# Altium project BLDC_Motor_Controller.PrjPcb
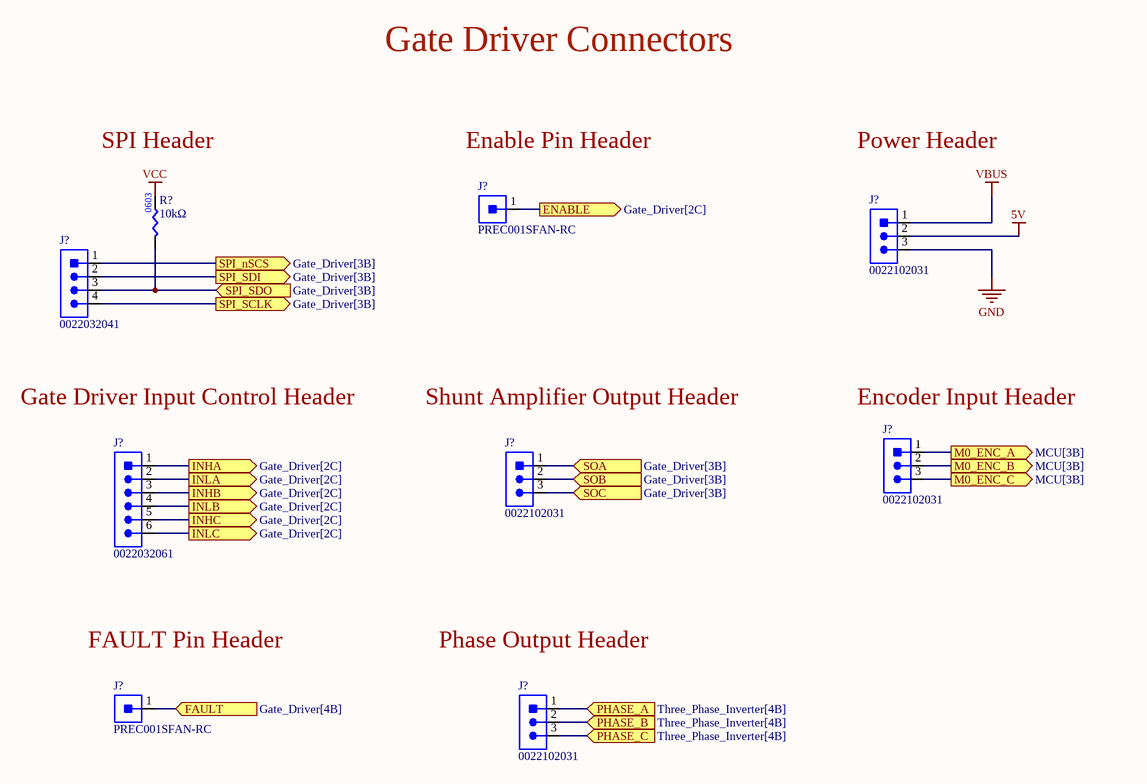
[diagram p0: Gate_Driver_Connectors.SchDoc]
4 sheets, 82 parts. Net scope: flat (ports and power ports of the same name join across sheets).
Sheets:
  Gate_Driver_Connectors.SchDoc
  Gate_Driver.SchDoc
  MCU.SchDoc
  Three_Phase_Inverter.SchDoc

## Sheet Gate_Driver_Connectors.SchDoc
size A4; SheetNumber: 1; SheetTotal: 5

### Parts
(Parts that share a designator on the sheet are numbered #1, #2 ... from top to bottom, then left to right.)
J?#1  Manufacturer Part Number: PREC001SFAN-RC  [HDR_MALE_1X1]  (hidden comment: CON_1X1_2.54MM_MALE_TH_HDR)
J?#2  CON_3X1_2.54MM_MALE_TH_HDR  [0022102031]  (value not drawn)
J?#3  CON_4X1_2.54MM_MALE_TH_HDR  [0022032041]  (value not drawn)
J?#4  CON_3X1_2.54MM_MALE_TH_HDR  [0022102031]  (value not drawn)
J?#5  Manufacturer Part Number 1: 0022032061  [0022284060]  (hidden comment: CON_6X1_2.54MM_MALE_TH_HDR)
J?#6  CON_3X1_2.54MM_MALE_TH_HDR  [0022102031]  (value not drawn)
J?#7  Manufacturer Part Number: PREC001SFAN-RC  [HDR_MALE_1X1]  (hidden comment: CON_1X1_2.54MM_MALE_TH_HDR)
J?#8  CON_3X1_2.54MM_MALE_TH_HDR  [0022102031]  (value not drawn)
R?#1  value 10kΩ  [RES0603]  (hidden comment: RES_10kΩ_0603_1%)

### Ports
ENABLE (out, see Gate_Driver[2C]), FAULT (in, see Gate_Driver[4B]), INHA (out, see Gate_Driver[2C]), INHB (out, see Gate_Driver[2C]), INHC (out, see Gate_Driver[2C]), INLA (out, see Gate_Driver[2C]), INLB (out, see Gate_Driver[2C]), INLC (out, see Gate_Driver[2C]), M0_ENC_A (out, see MCU[3B]), M0_ENC_B (out, see MCU[3B]), M0_ENC_C (out, see MCU[3B]), PHASE_A (in, see Three_Phase_Inverter[4B]), PHASE_B (in, see Three_Phase_Inverter[4B]), PHASE_C (in, see Three_Phase_Inverter[4B]), SOA (in, see Gate_Driver[3B]), SOB (in, see Gate_Driver[3B]), SOC (in, see Gate_Driver[3B]), SPI_nSCS (out, see Gate_Driver[3B]), SPI_SCLK (out, see Gate_Driver[3B]), SPI_SDI (out, see Gate_Driver[3B]), SPI_SDO (in, see Gate_Driver[3B])

### Nets
5V: J?#2.2
GND: J?#2.3
VBUS: J?#2.1
VCC: R?#1.2
NetC?#24_2: J?#8.1 ; port PHASE_A
NetC?#25_2: J?#8.2 ; port PHASE_B
NetC?#26_2: J?#8.3 ; port PHASE_C
NetJ?#1_1: J?#1.1 ; port ENABLE
NetJ?#3_1: J?#3.1 ; port SPI_nSCS
NetJ?#3_2: J?#3.2 ; port SPI_SDI
NetJ?#3_3: J?#3.3 R?#1.1 ; port SPI_SDO
NetJ?#3_4: J?#3.4 ; port SPI_SCLK
NetJ?#4_1: J?#4.1 ; port M0_ENC_A
NetJ?#4_2: J?#4.2 ; port M0_ENC_B
NetJ?#4_3: J?#4.3 ; port M0_ENC_C
NetJ?#5_1: J?#5.1 ; port INHA
NetJ?#5_2: J?#5.2 ; port INLA
NetJ?#5_3: J?#5.3 ; port INHB
NetJ?#5_4: J?#5.4 ; port INLB
NetJ?#5_5: J?#5.5 ; port INHC
NetJ?#5_6: J?#5.6 ; port INLC
NetJ?#6_1: J?#6.1 ; port SOA
NetJ?#6_2: J?#6.2 ; port SOB
NetJ?#6_3: J?#6.3 ; port SOC
NetJ?#7_1: J?#7.1 ; port FAULT

### Notes on the sheet
- Gate Driver Connectors
- SPI Header
- Enable Pin Header
- Power Header
- Gate Driver Input Control Header
- Shunt Amplifier Output Header
- (near J?#4) Encoder Input Header
- FAULT Pin Header
- Phase Output Header

### Library data of the parts
J?#1 J?#7 = CON_1X1_2.54MM_MALE_TH_HDR: Male Conn Header Vert 1POS Through Hole; Manufacturer: Sullins; Number of Positions: 1; Connector Type: Male Pin; Supplier 1: Digi-Key; RoHS: Yes; Category: Connectors; Stock 1: 29218; Pricing 1: 1=0.05000, 10=0.03400, 25=0.03160, 50=0.02360, 100=0.02020, 250=0.01948, 500=0.01680 (USD); Mount: Through Hole; Color: Black; Contact Plating: Tin; Package Quantity: 1; Number of Rows: 1; Packaging: Bulk; Termination: Solder; Series: -; Contact Type: Male Pin; Contact Mating Length: 0.318inch; ComponentLink1URL: https://datasheet.ciiva.com/740/xrxczzzsxxn-rc-st-11635-b-740964.pdf?src-supplier=Digi-Key; ComponentLink1Description: https://datasheet.ciiva.com/740/xrxczzzsxxn-rc-st-11635-b-740964.pdf?src-supplier=Digi-Key; Supplier Part Number 1: S1212EC-01-ND
J?#2 J?#4 J?#6 J?#8 = CON_3X1_2.54MM_MALE_VERT_TH_HDR: CONN HEADER 3X1 2.54MM MALE VERT TH; Manufacturer 1: Molex; Number of Positions: 3; Supplier 1: Digi-Key; Mounting Type: Through Hole; Connector Type: Header; Contact Type: Male Pin; Pitch: 2.54mm; Number of Rows: 1; Supplier Part Number 1: WM2723-ND; Manufacturer Part Number 1: 0022102031
J?#3 = CON_4X1_2.54MM_MALE_TH_HDR: CONN HEADER 4X1 2.54MM MALE VERT TH; Manufacturer 1: Molex; Number of Positions: 4; Supplier 1: Digi-Key; Supplier Part Number 1: WM4002-ND; Mounting Type: Through Hole; Connector Type: Header; Contact Type: Male Pin; Pitch: 2.54mm; Number of Rows: 1; Manufacturer Part Number 1: 0022032041
J?#5 = CON_6X1_2.54MM_MALE_TH_HDR: CONN HEADER 6X1 2.54MM MALE VERT TH; Manufacturer 1: Molex; Number of Positions: 6; Mounting Type: Through Hole; Pitch: 2.54mm; Number of Rows: 1; Connector Type: Header; Contact Type: Male Pin; Supplier 1: Digi-Key; Supplier Part Number 1: WM4004-ND
R?#1 = RES_10kΩ_0603_1%: RES 10K OHM ±1% 1/10W 0603; Manufacturer 1: Yageo; Manufacturer Part Number 1: RC0603FR-0710KL; Supplier 1: Digi-Key; Supplier Part Number 1: 311-10.0KHRCT-ND; Tolerance: ±1%; Package: 0603; Mounting Type: Surface Mount; Power Rating: 1/10W

## Sheet Gate_Driver.SchDoc
size A4; SheetNumber: 2; SheetTotal: 5
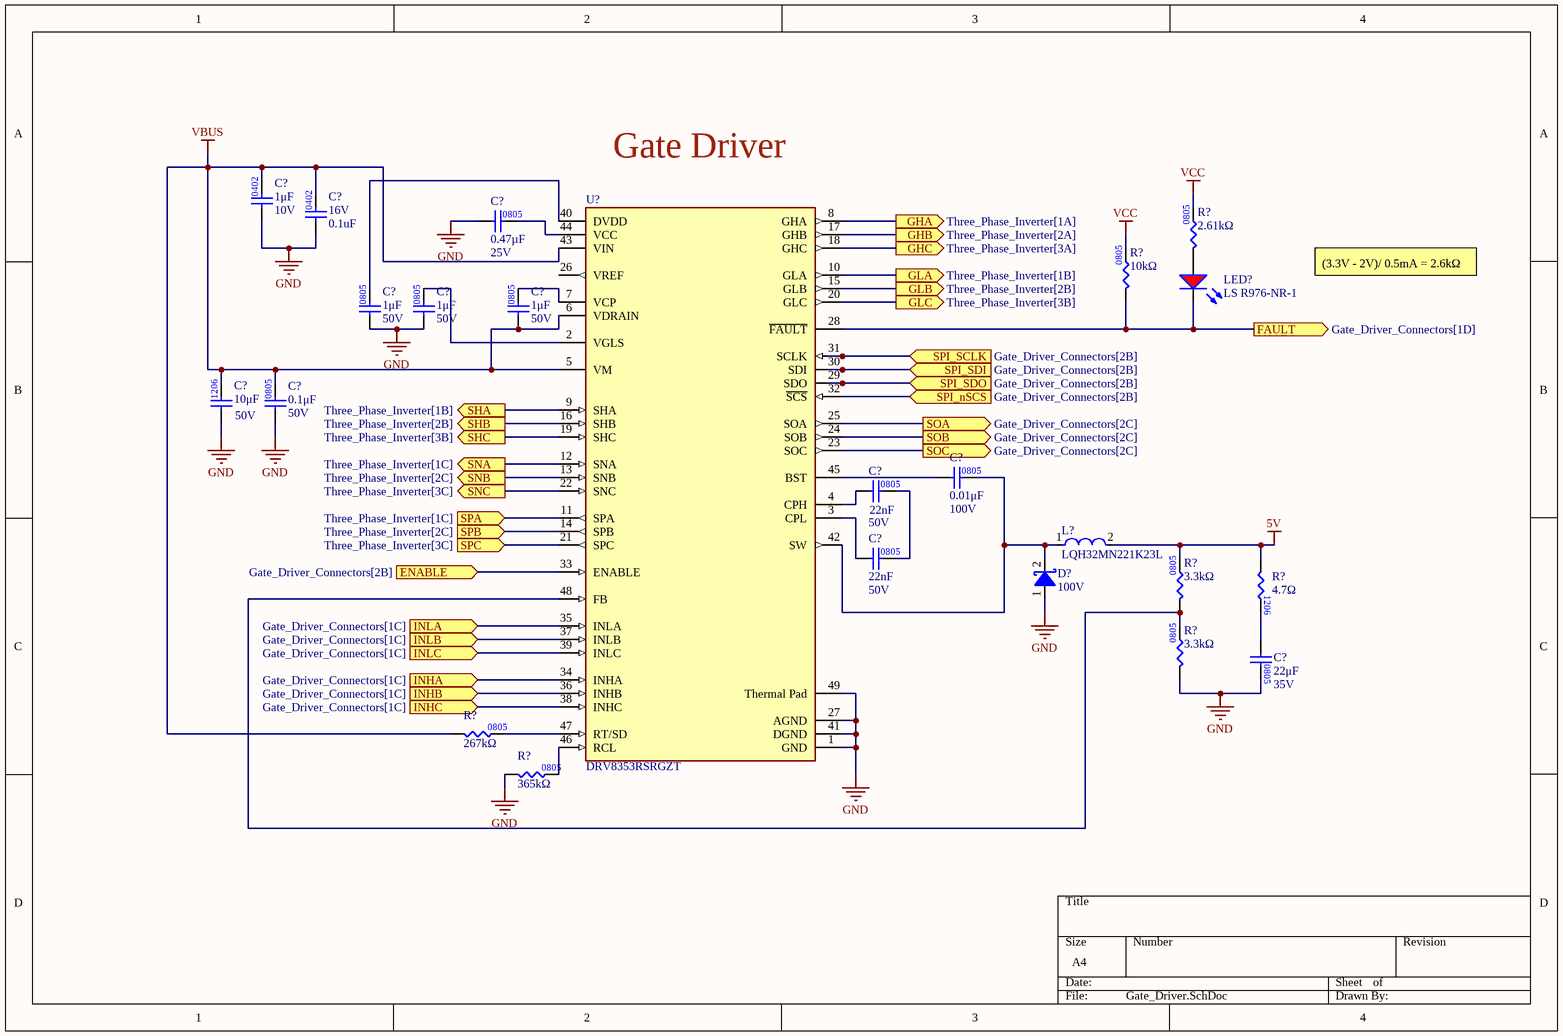
[diagram p1: Gate_Driver.SchDoc]

### Parts
(Parts that share a designator on the sheet are numbered #1, #2 ... from top to bottom, then left to right.)
C?#1  Capacitance: 1μF  Rated DC Voltage (URdc): 10V  [CAP0402]  (hidden comment: CAP_1UF_10V_0402_X5R)
C?#2  value 0.47µF  Voltage Rating: 25V  [CAP0805]  (hidden comment: CAP_0.47uF_25V_0805)
C?#3  Voltage Rating: 16V  Capacitance: 0.1uF  [CAP0402]  (hidden comment: CAP_0.1uF_16V_X7R_0402)
C?#4  value 1μF  Voltage Rating: 50V  [CAP0805]  (hidden comment: CAP_1uF_50V_0805)
C?#5  value 1μF  Voltage Rating: 50V  [CAP0805]  (hidden comment: CAP_1uF_50V_0805)
C?#6  value 1μF  Voltage Rating: 50V  [CAP0805]  (hidden comment: CAP_1uF_50V_0805)
C?#7  value 10μF  Voltage Rating: 50V  [CAP1206]  (hidden comment: CAP_10uF_50V_1206)
C?#8  value 0.1μF  Voltage Rating: 50V  [CAP0805]  (hidden comment: CAP_0.1uF_50V_0805)
C?#9  value 0.01μF  Voltage Rating: 100V  [CAP0805]  (hidden comment: CAP_0.01uF_100V_0805)
C?#10  value 22nF  Voltage Rating: 50V  [CAP2012]  (hidden comment: CAP_22nF_50V_0805_2)
C?#11  value 22nF  Voltage Rating: 50V  [CAP2012]  (hidden comment: CAP_22nF_50V_0805_2)
C?#12  value 22μF  Voltage Rating: 35V  [CAP0805]  (hidden comment: CAP_22uF_35V_0805_±20%)
D?  Vr (Max): 100V  [SOD-123FL]  (hidden comment: DIO_SCHOTTKY_100V_1A)
L?  LQH32MN221K23L  [FP-LQH32CH_23-MFG]
LED?#1  Manufacturer Part Number 1: LS R976-NR-1  [LED_0805_RED]  (hidden comment: LED_RED)
R?#2  value 2.61kΩ  [RES0805]  (hidden comment: RES_2.61kΩ_0805_1%)
R?#3  value 10kΩ  [RES0805]  (hidden comment: RES_10kΩ_0805_5%)
R?#4  value 4.7Ω  [RES1206]  (hidden comment: RES_4.7Ω_1206_1%)
R?#5  value 3.3kΩ  [RES0805]  (hidden comment: RES_3.3kΩ_0805_1%)
R?#6  value 3.3kΩ  [RES0805]  (hidden comment: RES_3.3kΩ_0805_1%)
R?#7  value 267kΩ  [RES0805]  (hidden comment: RES_267kΩ_0805_1%)
R?#8  value 365kΩ  [RES0805]  (hidden comment: RES_365kΩ_0805_1%)
U?#1  DRV8353RSRGZT  [FP-RGZ0048L-IPC_A]

### Ports
ENABLE (in, see Gate_Driver_Connectors[2B]), FAULT (out, see Gate_Driver_Connectors[1D]), GHA (out, see Three_Phase_Inverter[1A]), GHB (out, see Three_Phase_Inverter[2A]), GHC (out, see Three_Phase_Inverter[3A]), GLA (out, see Three_Phase_Inverter[1B]), GLB (out, see Three_Phase_Inverter[2B]), GLC (out, see Three_Phase_Inverter[3B]), INHA (in, see Gate_Driver_Connectors[1C]), INHB (in, see Gate_Driver_Connectors[1C]), INHC (in, see Gate_Driver_Connectors[1C]), INLA (in, see Gate_Driver_Connectors[1C]), INLB (in, see Gate_Driver_Connectors[1C]), INLC (in, see Gate_Driver_Connectors[1C]), SHA (out, see Three_Phase_Inverter[1B]), SHB (out, see Three_Phase_Inverter[2B]), SHC (out, see Three_Phase_Inverter[3B]), SNA (out, see Three_Phase_Inverter[1C]), SNB (out, see Three_Phase_Inverter[2C]), SNC (out, see Three_Phase_Inverter[3C]), SOA (out, see Gate_Driver_Connectors[2C]), SOB (out, see Gate_Driver_Connectors[2C]), SOC (out, see Gate_Driver_Connectors[2C]), SPA (in, see Three_Phase_Inverter[1C]), SPB (in, see Three_Phase_Inverter[2C]), SPC (in, see Three_Phase_Inverter[3C]), SPI_nSCS (in, see Gate_Driver_Connectors[2B]), SPI_SCLK (in, see Gate_Driver_Connectors[2B]), SPI_SDI (in, see Gate_Driver_Connectors[2B]), SPI_SDO (in, see Gate_Driver_Connectors[2B])

### Nets
5V: L?.2 R?#4.1 R?#5.2
GND: C?#1.1 C?#2.1 C?#3.1 C?#4.1 C?#5.1 C?#7.1 C?#8.1 C?#12.2 D?.1(Anode) R?#6.1 R?#8.1 U?#1.1(GND) U?#1.12(SNA) U?#1.13(SNB) U?#1.22(SNC) U?#1.27(AGND) U?#1.41(DGND) U?#1.49(Thermal_Pad) ; port SNA, port SNB, port SNC
VBUS: C?#1.2 C?#3.2 C?#6.1 C?#7.2 C?#8.2 R?#7.1 U?#1.5(VM) U?#1.6(VDRAIN) U?#1.43(VIN)
VCC: R?#2.2 R?#3.2
NetC?#2_2: C?#2.2 U?#1.44(VCC)
NetC?#4_2: C?#4.2 U?#1.40(DVDD)
NetC?#5_2: C?#5.2 U?#1.2(VGLS)
NetC?#6_2: C?#6.2 U?#1.7(VCP)
NetC?#9_1: C?#9.1 U?#1.45(BST)
NetC?#9_2: C?#9.2 D?.2(Cathode) L?.1 U?#1.42(SW)
NetC?#10_1: C?#10.1 U?#1.4(CPH)
NetC?#10_2: C?#10.2 C?#11.2
NetC?#11_1: C?#11.1 U?#1.3(CPL)
NetC?#12_1: C?#12.1 R?#4.2
NetC?#24_2: U?#1.9(SHA) ; port SHA
NetC?#25_2: U?#1.16(SHB) ; port SHB
NetC?#26_2: U?#1.19(SHC) ; port SHC
NetJ?#1_1: U?#1.33(ENABLE) ; port ENABLE
NetJ?#3_1: U?#1.32(~{SCS}) ; port SPI_nSCS
NetJ?#3_2: U?#1.30(SDI) ; port SPI_SDI
NetJ?#3_3: U?#1.29(SDO) ; port SPI_SDO
NetJ?#3_4: U?#1.31(SCLK) ; port SPI_SCLK
NetJ?#5_1: U?#1.34(INHA) ; port INHA
NetJ?#5_2: U?#1.35(INLA) ; port INLA
NetJ?#5_3: U?#1.36(INHB) ; port INHB
NetJ?#5_4: U?#1.37(INLB) ; port INLB
NetJ?#5_5: U?#1.38(INHC) ; port INHC
NetJ?#5_6: U?#1.39(INLC) ; port INLC
NetJ?#6_1: U?#1.25(SOA) ; port SOA
NetJ?#6_2: U?#1.24(SOB) ; port SOB
NetJ?#6_3: U?#1.23(SOC) ; port SOC
NetJ?#7_1: LED?#1.2(K) R?#3.1 U?#1.28(~{FAULT}) ; port FAULT
NetLED?#1_1: LED?#1.1(A) R?#2.1
NetQ?#1_2: U?#1.8(GHA) ; port GHA
NetQ?#2_2: U?#1.17(GHB) ; port GHB
NetQ?#3_2: U?#1.18(GHC) ; port GHC
NetQ?#4_2: U?#1.10(GLA) ; port GLA
NetQ?#4_3: U?#1.11(SPA) ; port SPA
NetQ?#5_2: U?#1.15(GLB) ; port GLB
NetQ?#5_3: U?#1.14(SPB) ; port SPB
NetQ?#6_2: U?#1.20(GLC) ; port GLC
NetQ?#6_3: U?#1.21(SPC) ; port SPC
NetR?#5_1: R?#5.1 R?#6.2 U?#1.48(FB)
NetR?#7_2: R?#7.2 U?#1.47(RT/SD)
NetR?#8_2: R?#8.2 U?#1.46(RCL)

Not connected (* = marked no-connect by the designer): U?#1 26(VREF)

### Notes on the sheet
- Gate Driver
- (3.3V - 2V)/ 0.5mA = 2.6kΩ
- (in symbol RES_365kΩ_0805_1%) 0805

### Library data of the parts
C?#1 = CAP_1UF_10V_0402_X5R: CAP CER 1UF 10V X5R 0402; Manufacturer: Kyocera AVX; Manufacturer Part Number: 0402ZD105MAT2A; Supplier 1: Digi-Key; Supplier Part Number 1: 478-5768-1-ND; Mounting Type: Surface Mount; Package: 0402; Temperature Characteristics Code: X5R; ComponentLink7URL: https://datasheet.ciiva.com/11531/cx5r-11531784.pdf?src-supplier=Avnet; ComponentLink7Description: https://datasheet.ciiva.com/11531/cx5r-11531784.pdf?src-supplier=Avnet
C?#2 = CAP_0.47uF_25V_0805: CAP CER 0.47UF 25V X5R 0805; Manufacturer 1: KEMET; Manufacturer Part Number 1: C0805C474K3PAC7800; Package: 0805; Supplier 1: Digi-Key; Supplier Part Number 1: 399-15508-1-ND
C?#3 = CAP_0.1uF_16V_X7R_0402: CAP CER 0.1UF 16V X7R 0402; Supplier 1: Digi-Key; Mounting Type: Surface Mount; Package: 0402
C?#4-C?#6 = CAP_1uF_50V_0805: CAP CER 1UF 50V X7R 0805; Manufacturer Part Number 1: CL21B105KBFNNNG; Manufacturer 1: Samsung Electro-Mechanics; Supplier Part Number 1: 1276-6470-1-ND; Supplier 1: Digi-Key; Mounting Type: SMD; LCSC Part #: C28323; Package: 0805
C?#7 = CAP_10uF_50V_1206: CAP CER 10UF 50V X5R 1206; Manufacturer 1: Murata; Manufacturer Part Number 1: GRT31CR61H106KE01L; Supplier Part Number 1: 490-12456-1-ND; Supplier 1: Digi-Key; Mounting Type: SMD; Package: 1206; Dielectric: X5R
C?#8 = CAP_0.1uF_50V_0805: CAP CER 0.1UF 50V X7R 0805; Manufacturer 1: Murata Electronics; Manufacturer Part Number 1: GCM21BR71H104KA37K; Package/Footprint: 0805; Mounting Type: SMD; Supplier 1: Digi-Key; Supplier Part Number 1: 490-8049-1-ND; Dielectric: X7R; LCSC Part #: C49678
C?#9 = CAP_0.01uF_100V_0805: CAP CER 0.01uF 100V X7R 0805; Manufacturer 1: AVX Corporation; Manufacturer Part Number 1: 08051C103KAT2A; Mounting Type: SMD; Supplier 1: Digi-Key; Supplier Part Number 1: 478-1358-1-ND; Package: 0805; LCSC Part #: C1710; Dielectric: X7R
C?#10 C?#11 = CAP_22nF_50V_0805_2: CAP CER 22nF 50V 0805; Manufacturer Part Number 1: CL21B223KBANFNC; Manufacturer 1: KEMET; Supplier Part Number 1: 1276-2488-1-ND; Supplier 1: Digi-Key; Mounting Type: SMD; Package: 0805
C?#12 = CAP_22uF_35V_0805_±20%: CAP CER 22UF 35V 0805 ±20%; Manufacturer 1: TDK Corporation; Manufacturer Part Number 1: C2012X5R1V226M125AC; Package/Footprint: 0805; Supplier 1: Digi-Key; Supplier Part Number 1: 445-14428-1-ND; Mounting Type: SMD
D? = DIO_SCHOTTKY_100V_1A: DIODE SCHOTTKY 100V 1A SOD-123F; Manufacturer 1: SMC Diode Solutions; Manufacturer Part Number 1: DSS110U; Supplier 1: Digi-Key; Supplier Part Number 1: 1655-DSS110UCT-ND; Mounting Type: SMD; Package/Footprint: SOD-123F
L? = CMP-06042-005447-2: Wire Wound Ferrite Inductor for General Circuits 220μH ±10% 11.8Ω 65mA 1210; Shielding: Unshielded; Series Resistance: 11.8R; Frequency: 5.5MHz; Test Frequency: 1MHz; Inductance: 220uH; Q Factor: 40; RoHS Compliant: Yes; Resistor Type: Wirewound; Mount: Surface Mount; Max Operating Temperature: 85°C; Case Code (Metric): 3225; DC Resistance (DCR): 11.8R; Height: 0.061inch; Width: 2.5mm; Case Code (Imperial): 1210; Height - Seated (Max): 0.087inch; Radiation Hardening: No; Tolerance: 10%; Weight: 0.002116oz; Case/Package: 1210; Military Standard: Not; Length: 3.2mm; DC Current: 65mA; Core Material: Ferrite; Package Quantity: 2000; Min Operating Temperature: -40°C; Packaging: Tape and Reel; Series: LQH32M; Self Resonant Frequency: 5.5MHz; Current Rating: 65mA; Max DC Current: 65mA; Termination: SMD/SMT; Depth: 2.7mm
LED?#1 = LED_RED: LED RED DIFFUSED 0805 SMD; Manufacturer 1: OSRAM; Package/Footprint: 0805; Forward Voltage Drop: 2V; Forward Current: 20mA; Supplier Part Number 1: 475-1278-1-ND; Supplier 1: Digi-Key; Mounting Type: SMD
R?#2 = RES_2.61kΩ_0805_1%: RES 2.61K OHM 1% 1/8W 0805; Manufacturer 1: Vishay Dale; Manufacturer Part Number 1: RC0805FR-072K61L; Package/Footprint: 0805; Supplier 1: Digi-Key; Mounting Type: SMD; Supplier Part Number 1: 311-2.61KCRCT-ND
R?#3 = RES_10kΩ_0805_5%: RES 10K OHM 5% 1/8W 0805; Manufacturer 1: Panasonic Electronic Components; Manufacturer Part Number 1: ERJ-6GEYJ103V; Package/Footprint: 0805; Supplier 1: Digi-Key; Supplier Part Number 1: P10KACT-ND; LCSC Part #: C17414; Mounting Type: SMD
R?#4 = RES_4.7Ω_1206_1%: RES 4.7 OHM 1% 1/2W 1206; Manufacturer 1: Stackpole Electronics Inc; Manufacturer Part Number 1: RNCP1206FTD4R70; Package/Footprint: 1206; Mounting Type: SMD; Supplier 1: Digi-Key; Supplier Part Number 1: RNCP1206FTD4R70CT-ND
R?#5 R?#6 = RES_3.3kΩ_0805_1%: RES 3.3K OHM 1% 1/8W 0805; Manufacturer 1: Vishay Dale; Manufacturer Part Number 1: CRCW06033K30FKEA; Mounting Type: SMD; Supplier 1: Digi-Key; Supplier Part Number 1: 541-3.30KHCT-ND; LCSC Part #: C26010; Package: 0805
R?#7 = RES_267kΩ_0805_1%: RES 267K OHM 1% 1/8W 0805; Manufacturer 1: Yageo; Manufacturer Part Number 1: RC0603FR-071K2L; Supplier 1: Digi-Key; Supplier Part Number 1: 311-267KCRCT-ND; Package: 0805
R?#8 = RES_365kΩ_0805_1%: RES 365K OHM 1% 1/8W 0805; Manufacturer 1: Stackpole Electronics Inc; Manufacturer Part Number 1: RMCF0805FT365K; Supplier 1: Digi-Key; Supplier Part Number 1: RMCF0805FT365KCT-ND
U?#1 = CMP-04912-000076-1: IC MTR DRV MULTIPHAS 6-95V 48QFN; Interface: SPI; Output Current: 25mA; Packaging: Cut Tape; Min Operating Temperature: -40°C; Mount: Surface Mount; Max Operating Temperature: 125°C; Case/Package: VQFN; RoHS Compliant: Yes

## Sheet MCU.SchDoc
size A4; SheetNumber: 3; SheetTotal: 5
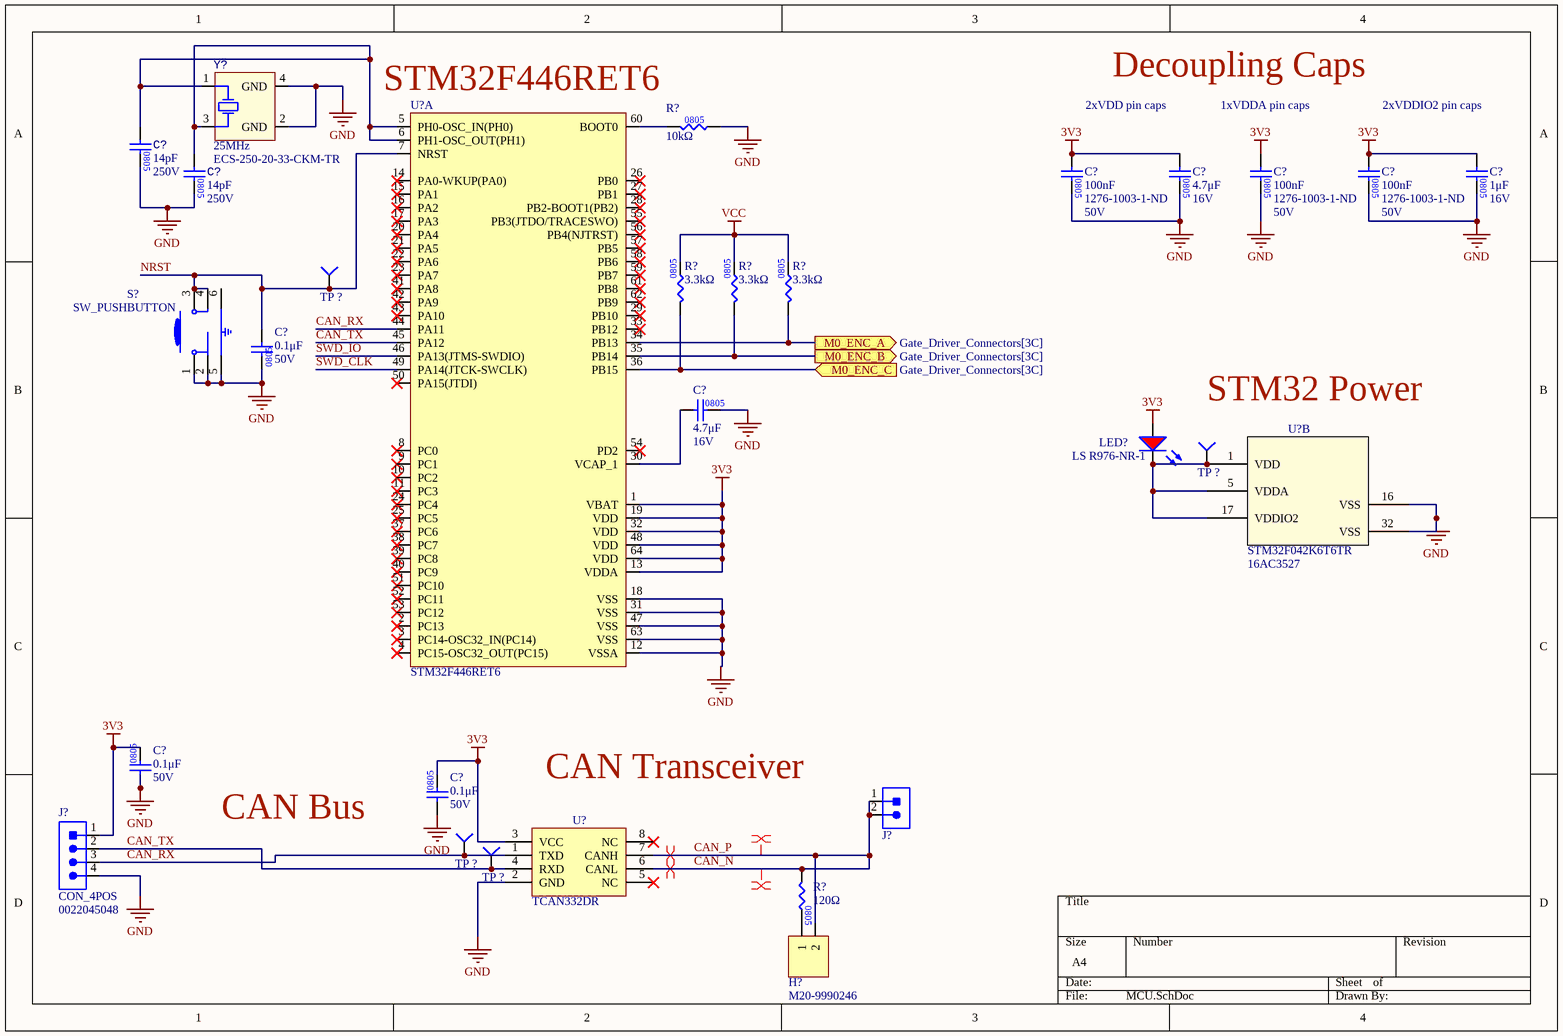
[diagram p2: MCU.SchDoc]

### Parts
(Parts that share a designator on the sheet are numbered #1, #2 ... from top to bottom, then left to right.)
C?#13  value 14pF  Voltage Rating: 250V  [CAP0805]  (hidden comment: CAP_14pF_50V_0805)
C?#14  value 14pF  Voltage Rating: 250V  [CAP0805]  (hidden comment: CAP_14pF_50V_0805)
C?#15  value 100nF  Supplier Part Number 1: 1276-1003-1-ND  Voltage Rating: 50V  [CAP0805]  (hidden comment: CAP_100nF_50V_0805)
C?#16  value 4.7μF  Voltage Rating: 16V  [CAP0805]  (hidden comment: CAP_4.7uF_16V_0805)
C?#17  value 100nF  Supplier Part Number 1: 1276-1003-1-ND  Voltage Rating: 50V  [CAP0805]  (hidden comment: CAP_100nF_50V_0805)
C?#18  value 100nF  Supplier Part Number 1: 1276-1003-1-ND  Voltage Rating: 50V  [CAP0805]  (hidden comment: CAP_100nF_50V_0805)
C?#19  value 1μF  Voltage Rating: 16V  [CAP0805]  (hidden comment: CAP_1uF_16V_0805)
C?#20  value 0.1μF  Voltage Rating: 50V  [CAP2012]  (hidden comment: CAP_0.1uF_50V_0805)
C?#21  value 4.7μF  Voltage Rating: 16V  [CAP0805]  (hidden comment: CAP_4.7uF_16V_0805)
C?#22  value 0.1μF  Voltage Rating: 50V  [CAP0805]  (hidden comment: CAP_0.1uF_50V_0805)
C?#23  value 0.1μF  Voltage Rating: 50V  [CAP0805]  (hidden comment: CAP_0.1uF_50V_0805)
H?  Manufacturer Part Number 1: M20-9990246  [HDR1X2]  (hidden comment: HEADER)
J?#9  CON_2POS_SCREW_TERM  [1935161]  (value not drawn)
J?#10  CON_4POS  Manufacturer Part Number: 0022045048
LED?#2  Manufacturer Part Number 1: LS R976-NR-1  [LED_0805_RED]  (hidden comment: LED_RED)
R?#9  value 10kΩ  [RES0805]  (hidden comment: RES_10kΩ_0805_5%)
R?#10  value 3.3kΩ  [RES0805]  (hidden comment: RES_3.3kΩ_0805_1%)
R?#11  value 3.3kΩ  [RES0805]  (hidden comment: RES_3.3kΩ_0805_1%)
R?#12  value 3.3kΩ  [RES0805]  (hidden comment: RES_3.3kΩ_0805_1%)
R?#13  value 120Ω  [RES0805]  (hidden comment: RES_120Ω_0805_1%)
S?  SW_PUSHBUTTON  [TACTILE_SWITCH_SMD]
TP_?#1  TESTPOINT_1MM_CIRCLE  [TESTPOINT_CIRCLE_1MM]  (value not drawn)  (no BOM)
TP_?#2  TESTPOINT_1MM_CIRCLE  [TESTPOINT_CIRCLE_1MM]  (value not drawn)  (no BOM)
TP_?#3  TESTPOINT_1MM_CIRCLE  [TESTPOINT_CIRCLE_1MM]  (value not drawn)  (no BOM)
TP_?#4  TESTPOINT_1MM_CIRCLE  [TESTPOINT_CIRCLE_1MM]  (value not drawn)  (no BOM)
U?#2  STM32F446RET6  [STM_LQFP64_N]  (part A of 3)
U?#3  STM32F042K6T6TR  Supplier Part Number 1: 16AC3527  [LQFP-32]  (part B of 2)
U?#4  TCAN332DR  [SOIC127P599X175-8N]
Y?  Frequency: 25MHz  Manufacturer Part Number 1: ECS-250-20-33-CKM-TR  [XTAL_ECS-250-20-33-CKM-TR]  (hidden comment: CRYSTAL_25MHZ_20PF)

### Ports
M0_ENC_A (out, see Gate_Driver_Connectors[3C]), M0_ENC_B (out, see Gate_Driver_Connectors[3C]), M0_ENC_C (in, see Gate_Driver_Connectors[3C])

### Nets
3V3: C?#15.1 C?#16.1 C?#17.1 C?#18.1 C?#19.1 C?#22.2 C?#23.2 J?#10.1 LED?#2.1(A) U?#2.1(VBAT) U?#2.13(VDDA) U?#2.19(VDD) U?#2.32(VDD) U?#2.48(VDD) U?#2.64(VDD) U?#4.3(VCC)
GND: C?#13.2 C?#14.2 C?#15.2 C?#16.2 C?#17.2 C?#18.2 C?#19.2 C?#20.1 C?#21.2 C?#22.1 C?#23.1 J?#10.4 R?#9.1 S?.1 S?.2 S?.5 U?#2.12(VSSA) U?#2.18(VSS) U?#2.31(VSS) U?#2.47(VSS) U?#2.63(VSS) U?#3.16(VSS) U?#3.32(VSS) U?#4.2(GND) Y?.2(GND) Y?.4(GND)
VCC: R?#10.2 R?#11.2 R?#12.2
CAN_N: H?.2 J?#9.1 J?#9.2 R?#13.1 U?#4.6(CANL) U?#4.7(CANH)  [also labelled CAN_P]
CAN_RX: J?#10.3 TP_?#3.1(=value) U?#2.44(PA11) U?#4.1(TXD)
CAN_TX: J?#10.2 TP_?#4.1(=value) U?#2.45(PA12) U?#4.4(RXD)
NRST: C?#20.2 S?.3 S?.4 TP_?#1.1(=value) U?#2.7(NRST)
SWD_CLK: U?#2.49(PA14(JTCK-SWCLK))
SWD_IO: U?#2.46(PA13(JTMS-SWDIO))
NetC?#13_1: C?#13.1 C?#14.1 U?#2.5(PH0-OSC_IN(PH0)) U?#2.6(PH1-OSC_OUT(PH1)) Y?.1(HOT) Y?.3(HOT)
NetC?#21_1: C?#21.1 U?#2.30(VCAP_1)
NetH?_1: H?.1 R?#13.2
NetJ?#4_1: R?#12.1 U?#2.34(PB13) ; port M0_ENC_A
NetJ?#4_2: R?#11.1 U?#2.35(PB14) ; port M0_ENC_B
NetJ?#4_3: R?#10.1 U?#2.36(PB15) ; port M0_ENC_C
NetLED?#2_2: LED?#2.2(K) TP_?#2.1(=value) U?#3.1(VDD) U?#3.5(VDDA) U?#3.17(VDDIO2)
NetR?#9_2: R?#9.2 U?#2.60(BOOT0)

Not connected (* = marked no-connect by the designer): S? 6; U?#2 2(PC13)* 3(PC14-OSC32_IN(PC14))* 4(PC15-OSC32_OUT(PC15))* 8(PC0)* 9(PC1)* 10(PC2)* 11(PC3)* 14(PA0-WKUP(PA0))* 15(PA1)* 16(PA2)* 17(PA3)* 20(PA4)* 21(PA5)* 22(PA6)* 23(PA7)* 24(PC4)* 25(PC5)* 26(PB0)* 27(PB1)* 28(PB2-BOOT1(PB2))* 29(PB10)* 33(PB12)* 37(PC6)* 38(PC7)* 39(PC8)* 40(PC9)* 41(PA8)* 42(PA9)* 43(PA10)* 50(PA15(JTDI))* 51(PC10)* 52(PC11)* 53(PC12)* 54(PD2)* 55(PB3(JTDO/TRACESWO))* 56(PB4(NJTRST))* 57(PB5)* 58(PB6)* 59(PB7)* 61(PB8)* 62(PB9)*; U?#4 5(NC)* 8(NC)*

### Layout directives
differential pair: CAN_N

### Notes on the sheet
- (near U?#2) STM32F446RET6
- 2xVDD pin caps
- Decoupling Caps
- 1xVDDA pin caps
- 2xVDDIO2 pin caps
- STM32 Power
- CAN Transceiver
- CAN Bus

### Library data of the parts
C?#13 C?#14 = CAP_14pF_50V_0805: CERAMIC CAP MLCC HIGH-Q 125C; Manufacturer: Murata Electronics; Manufacturer Part Number: GQM2195C2E140JB12D; Mounting Type: SMD; Package: 0805; Supplier 1: Digi-Key; Supplier Part Number 1: 490-GQM2195C2E140JB12DCT-ND
C?#15 C?#17 C?#18 = CAP_100nF_50V_0805: CAP CER 0.1UF 50V X7R 0805; Manufacturer 1: Samsung Electro-Mechanics; Manufacturer Part Number 1: CL21B104KBCNNNC; Package/Footprint: 0805; Supplier 1: Digi-Key
C?#16 = CAP_4.7uF_16V_0805: CAP CER 4.7UF 16V X5R 0805; Manufacturer 1: Samsung Electro-Mechanics; Manufacturer Part Number 1: CL21A475KOFNNNE; Mounting Type: SMD; Supplier 1: Digi-Key; Supplier Part Number 1: 1276-1065-1-ND; Package: 0805; LCSC Part #: C1779; Dielectric: X5R
C?#19 = CAP_1uF_16V_0805: CAP CER 1UF 16V X7R 0805; Manufacturer 1: Yageo; Manufacturer Part Number 1: CC0805KKX7R7BB105; Mounting Type: SMD; Supplier 1: Digi-Key; Supplier Part Number 1: 311-1365-1-ND; Package: 0805; Dielectric: X7R
C?#20 = CAP_0.1uF_50V_0805: CAP CER 0.1UF 50V X7R 0805; Manufacturer Part Number 1: GCM21BR71H104KA37K; Manufacturer 1: Murata Electronics; Package/Footprint: 0805; Supplier Part Number 1: 490-8049-1-ND; Supplier 1: Digi-Key; Dielectric: X7R; LCSC Part #: C49678; Mounting Type: SMD
C?#21 = CAP_4.7uF_16V_0805: CAP CER 4.7UF 16V X5R 0805; Manufacturer Part Number 1: CL21A475KOFNNNE; Manufacturer 1: Samsung Electro-Mechanics; Supplier Part Number 1: 1276-1065-1-ND; Supplier 1: Digi-Key; Dielectric: X5R; LCSC Part #: C1779; Mounting Type: SMD; Package: 0805
C?#22 C?#23 = CAP_0.1uF_50V_0805: as C?#8 on sheet Gate_Driver; Mounting Type: SMD; Supplier 1: Digi-Key; Supplier Part Number 1: 490-8049-1-ND; Dielectric: X7R; LCSC Part #: C49678
H? = HEADER: HEADER 2X1; Manufacturer 1: Harwin Inc.; Package/Footprint: TH; Mounting Type: TH; Supplier 1: Digi-Key; Supplier Part Number 1: 952-2262-ND
J?#9 = CON_2POS_SCREW_TERM: TERM BLK 2POS SIDE ENTRY 5MM; Manufacturer 1: Phoenix Contact; Package/Footprint: SMD; Supplier 1: Digi-Key; Mounting Type: TH; Supplier Part Number 1: 277-1667-ND; Manufacturer Part Number 1: 1935161
J?#10 = CON_4POS: CONN HEADER VERT 4POS 2.54MM; Manufacturer: Molex; Supplier 1: Digi-Key; Supplier Part Number 1: 0022045048-ND; RoHS: Yes; Category: Headers and Wire Housings; Pricing 1: 16000=0.12858 (USD); ComponentLink1URL: https://datasheet.ciiva.com/6839/022045032-sd-6839882.pdf?src-supplier=Digi-Key; ComponentLink1Description: https://datasheet.ciiva.com/6839/022045032-sd-6839882.pdf?src-supplier=Digi-Key
LED?#2 = LED_RED: as LED?#1 on sheet Gate_Driver; Supplier Part Number 1: 475-1278-1-ND; Supplier 1: Digi-Key; Mounting Type: SMD
R?#9 = RES_10kΩ_0805_5%: as R?#3 on sheet Gate_Driver; Supplier Part Number 1: P10KACT-ND; Supplier 1: Digi-Key; LCSC Part #: C17414; Mounting Type: SMD
R?#10-R?#12 = RES_3.3kΩ_0805_1%: as R?#5 on sheet Gate_Driver; Mounting Type: SMD; Supplier 1: Digi-Key; Supplier Part Number 1: 541-3.30KHCT-ND; LCSC Part #: C26010; Package: 0805
R?#13 = RES_120Ω_0805_1%: RES 120 OHM 1% 1/8W 0805; Manufacturer 1: Vishay; Manufacturer Part Number 1: CRCW0805120RFKEA; Package/Footprint: 0805; Supplier 1: Digi-Key; Mounting Type: SMD; Supplier Part Number 1: 541-120CCT-ND; LCSC Part #: C17437
S? = SW_PUSHBUTTON: SMT 3.0 X 2.6 MM TACT SWITCH WIT; Manufacturer 1: Würth Elektronik; Manufacturer Part Number 1: 435151014824; Supplier 1: Digi-Key; Supplier Part Number 1: 732-435151014824CT-ND
TP_?#1-TP_?#4 = TESTPOINT_1MM_CIRCLE: TESTPOINT 1MM CIRCLE
U?#2 = STM32F446RET6: IC MCU 32BIT 512KB FLASH 64LQFP; Manufacturer 1: STMicroelectronics; Manufacturer Part Number 1: LF80CDT-TR; Supplier 1: Digi-Key; Supplier Part Number 1: 497-15376-ND
U?#3 = STM32F042K6T6TR: ARM® Cortex®-M0 STM32F0 Microcontroller IC 32-Bit Single-Core 48MHz 32KB (32K x 8) FLASH 32-LQFP (7x7); Mfr_Name: STMicroelectronics; Voltage - Supply (Vcc/Vdd): 2V ~ 3.6V; Core Processor: ARM® Cortex®-M0; Core Size: 32-Bit Single-Core; Speed: 48MHz; Program Memory Size: 32KB (32K x 8); Operating Temperature: -40°C ~ 85°C (TA); Package / Case: 32-LQFP; ComponentLink1Description: digikey; ComponentLink1URL: https://www.digikey.com/en/products/detail/stmicroelectronics/STM32F042K6T6TR/10414582; Supplier 1: Avnet
U?#4 = TCAN332DR: IC CAN TRANSCEIVER; Manufacturer 1: Texas Instruments; Manufacturer Part Number 1: TCAN332DR; Supplier 1: Digi-Key; Supplier Part Number 1: 296-43711-1-ND
Y? = CRYSTAL_25MHZ_20PF: CRYSTAL 25.0000MHZ 20PF SMD; Manufacturer 1: ECS Inc.; Load Capacitance: 20pF; Supplier 1: Digi-Key; Supplier Part Number 1: XC1817CT-ND; Mounting Type: SMD; Package/Footprint: SMD

## Sheet Three_Phase_Inverter.SchDoc
size A4; SheetNumber: 4; SheetTotal: 5
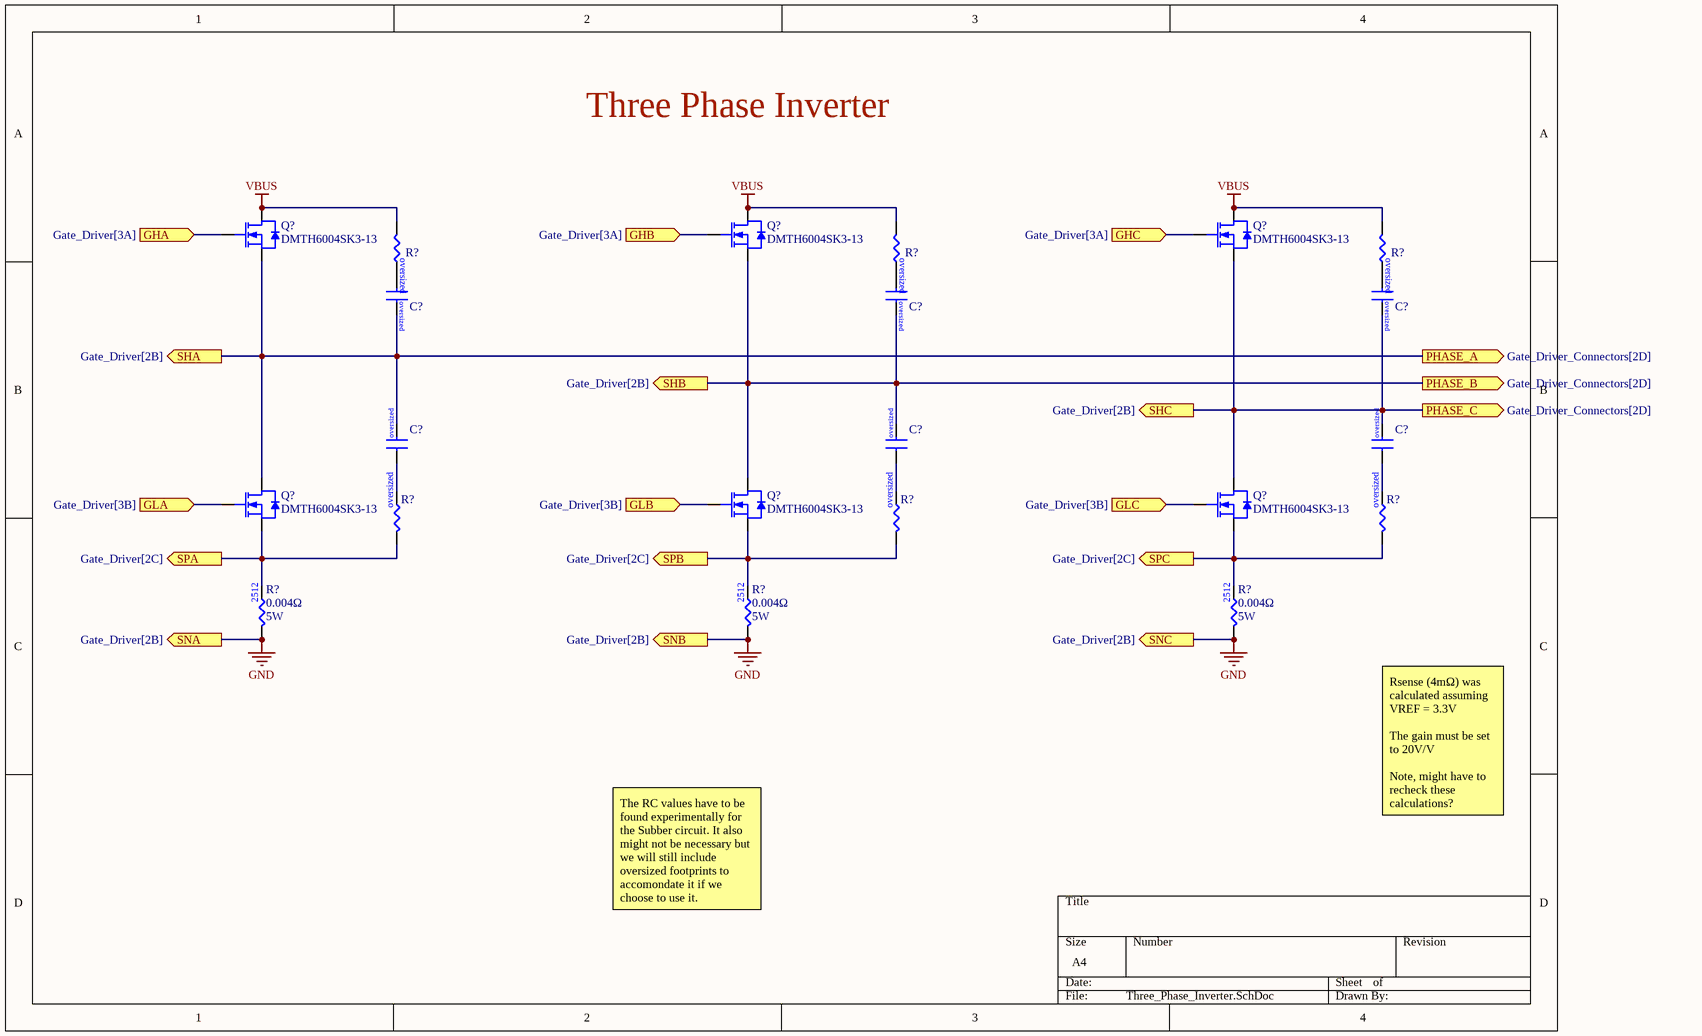
[diagram p3: Three_Phase_Inverter.SchDoc]

### Parts
(Parts that share a designator on the sheet are numbered #1, #2 ... from top to bottom, then left to right.)
C?#24  EMPTY PART FOR RC SNUBBER CIRCUIT  [RES/CAP_OVERSIZED]  (value not drawn)
C?#25  EMPTY PART FOR RC SNUBBER CIRCUIT  [RES/CAP_OVERSIZED]  (value not drawn)
C?#26  EMPTY PART FOR RC SNUBBER CIRCUIT  [RES/CAP_OVERSIZED]  (value not drawn)
C?#27  EMPTY PART FOR RC SNUBBER CIRCUIT  [RES/CAP_OVERSIZED]  (value not drawn)
C?#28  EMPTY PART FOR RC SNUBBER CIRCUIT  [RES/CAP_OVERSIZED]  (value not drawn)
C?#29  EMPTY PART FOR RC SNUBBER CIRCUIT  [RES/CAP_OVERSIZED]  (value not drawn)
Q?#1  Manufacturer Part Number 1: DMTH6004SK3-13  [D-PAK]  (hidden comment: NMOS_60V_100A)
Q?#2  Manufacturer Part Number 1: DMTH6004SK3-13  [D-PAK]  (hidden comment: NMOS_60V_100A)
Q?#3  Manufacturer Part Number 1: DMTH6004SK3-13  [D-PAK]  (hidden comment: NMOS_60V_100A)
Q?#4  Manufacturer Part Number 1: DMTH6004SK3-13  [D-PAK]  (hidden comment: NMOS_60V_100A)
Q?#5  Manufacturer Part Number 1: DMTH6004SK3-13  [D-PAK]  (hidden comment: NMOS_60V_100A)
Q?#6  Manufacturer Part Number 1: DMTH6004SK3-13  [D-PAK]  (hidden comment: NMOS_60V_100A)
R?#14  RES_OVERSIZED  [RES/CAP_OVERSIZED]  (value not drawn)
R?#15  RES_OVERSIZED  [RES/CAP_OVERSIZED]  (value not drawn)
R?#16  RES_OVERSIZED  [RES/CAP_OVERSIZED]  (value not drawn)
R?#17  RES_OVERSIZED  [RES/CAP_OVERSIZED]  (value not drawn)
R?#18  RES_OVERSIZED  [RES/CAP_OVERSIZED]  (value not drawn)
R?#19  RES_OVERSIZED  [RES/CAP_OVERSIZED]  (value not drawn)
R?#20  value 0.004Ω  Power: 5W  [RESC6532X75N]  (hidden comment: RES_4mΩ_2512_1%_5W)
R?#21  value 0.004Ω  Power: 5W  [RESC6532X75N]  (hidden comment: RES_4mΩ_2512_1%_5W)
R?#22  value 0.004Ω  Power: 5W  [RESC6532X75N]  (hidden comment: RES_4mΩ_2512_1%_5W)

### Ports
GHA (in, see Gate_Driver[3A]), GHB (in, see Gate_Driver[3A]), GHC (in, see Gate_Driver[3A]), GLA (in, see Gate_Driver[3B]), GLB (in, see Gate_Driver[3B]), GLC (in, see Gate_Driver[3B]), PHASE_A (out, see Gate_Driver_Connectors[2D]), PHASE_B (out, see Gate_Driver_Connectors[2D]), PHASE_C (out, see Gate_Driver_Connectors[2D]), SHA (out, see Gate_Driver[2B]), SHB (out, see Gate_Driver[2B]), SHC (out, see Gate_Driver[2B]), SNA (out, see Gate_Driver[2B]), SNB (out, see Gate_Driver[2B]), SNC (out, see Gate_Driver[2B]), SPA (out, see Gate_Driver[2C]), SPB (out, see Gate_Driver[2C]), SPC (out, see Gate_Driver[2C])

### Nets
GND: R?#20.1 R?#21.1 R?#22.1 ; port SNA, port SNB, port SNC
VBUS: Q?#1.1(Drain) Q?#2.1(Drain) Q?#3.1(Drain) R?#14.1 R?#15.1 R?#16.1
NetC?#24_1: C?#24.1 R?#14.2
NetC?#24_2: C?#24.2 C?#27.2 Q?#1.3(Source) Q?#4.1(Drain) ; port PHASE_A, port SHA
NetC?#25_1: C?#25.1 R?#15.2
NetC?#25_2: C?#25.2 C?#28.2 Q?#2.3(Source) Q?#5.1(Drain) ; port PHASE_B, port SHB
NetC?#26_1: C?#26.1 R?#16.2
NetC?#26_2: C?#26.2 C?#29.2 Q?#3.3(Source) Q?#6.1(Drain) ; port PHASE_C, port SHC
NetC?#27_1: C?#27.1 R?#17.2
NetC?#28_1: C?#28.1 R?#18.2
NetC?#29_1: C?#29.1 R?#19.2
NetQ?#1_2: Q?#1.2(Gate) ; port GHA
NetQ?#2_2: Q?#2.2(Gate) ; port GHB
NetQ?#3_2: Q?#3.2(Gate) ; port GHC
NetQ?#4_2: Q?#4.2(Gate) ; port GLA
NetQ?#4_3: Q?#4.3(Source) R?#17.1 R?#20.2 ; port SPA
NetQ?#5_2: Q?#5.2(Gate) ; port GLB
NetQ?#5_3: Q?#5.3(Source) R?#18.1 R?#21.2 ; port SPB
NetQ?#6_2: Q?#6.2(Gate) ; port GLC
NetQ?#6_3: Q?#6.3(Source) R?#19.1 R?#22.2 ; port SPC

### Notes on the sheet
- Three Phase Inverter
- Rsense (4mΩ) was calculated assuming VREF = 3.3V
  The gain must be set to 20V/V
  Note, might have to recheck these calculations?
- The RC values have to be found experimentally for the Subber circuit. It also might not be necessary but we will still include oversized footprints to accomondate it if we choose to use it.
- (in symbol CAP_OVERSIZED) oversized
- (in symbol RES_4mΩ_2512_1%_5W) 2512
- (in symbol RES_OVERSIZED) oversized

### Library data of the parts
C?#24-C?#29 = CAP_OVERSIZED: EMPTY PART FOR RC SNUBBER CIRCUIT (I just wanted the symbol and footprint to place)
Q?#1-Q?#6 = NMOS_60V_100A: MOSFET N-CH 60V 100A DPAK; Manufacturer 1: Diodes Incorporated; FET Type: N-Channel; Vgs (Max): 20V; Power Dissipation (Max): 180W; Supplier 1: Digi-Key; Supplier Part Number 1: DMTH6004SK3-13DICT-ND; Vdss: 60V; Supplier Device Package: D-PAK (TO-252); Id: 100A
R?#14-R?#19 = RES_OVERSIZED: EMPTY PART FOR RC SNUBBER CIRCUIT (I just wanted the symbol and footprint to place)
R?#20-R?#22 = RES_4mΩ_2512_1%_5W: RES 0.004 OHM 1% 2W 2512; Manufacturer 1: KOA Speer Electronics, Inc.; Manufacturer Part Number 1: TLR3APDTE4L00F50; Supplier 1: Digi-Key; Supplier Part Number 1: 2019-TLR3APDTE4L00F50CT-ND

## Nets that join several sheets
5V: Gate_Driver_Connectors (J?#2.2), Gate_Driver (L?.2 R?#4.1 R?#5.2)
GND: Gate_Driver_Connectors (J?#2.3), Gate_Driver (18 pins), MCU (26 pins), Three_Phase_Inverter (R?#20.1 R?#21.1 R?#22.1)
VBUS: Gate_Driver_Connectors (J?#2.1), Gate_Driver (9 pins), Three_Phase_Inverter (6 pins)
VCC: Gate_Driver_Connectors (R?#1.2), Gate_Driver (R?#2.2 R?#3.2), MCU (R?#10.2 R?#11.2 R?#12.2)
NetC?#24_2: Gate_Driver_Connectors (J?#8.1), Gate_Driver (U?#1.9), Three_Phase_Inverter (C?#24.2 C?#27.2 Q?#1.3 Q?#4.1)
NetC?#25_2: Gate_Driver_Connectors (J?#8.2), Gate_Driver (U?#1.16), Three_Phase_Inverter (C?#25.2 C?#28.2 Q?#2.3 Q?#5.1)
NetC?#26_2: Gate_Driver_Connectors (J?#8.3), Gate_Driver (U?#1.19), Three_Phase_Inverter (C?#26.2 C?#29.2 Q?#3.3 Q?#6.1)
NetJ?#1_1: Gate_Driver_Connectors (J?#1.1), Gate_Driver (U?#1.33)
NetJ?#3_1: Gate_Driver_Connectors (J?#3.1), Gate_Driver (U?#1.32)
NetJ?#3_2: Gate_Driver_Connectors (J?#3.2), Gate_Driver (U?#1.30)
NetJ?#3_3: Gate_Driver_Connectors (J?#3.3 R?#1.1), Gate_Driver (U?#1.29)
NetJ?#3_4: Gate_Driver_Connectors (J?#3.4), Gate_Driver (U?#1.31)
NetJ?#4_1: Gate_Driver_Connectors (J?#4.1), MCU (R?#12.1 U?#2.34)
NetJ?#4_2: Gate_Driver_Connectors (J?#4.2), MCU (R?#11.1 U?#2.35)
NetJ?#4_3: Gate_Driver_Connectors (J?#4.3), MCU (R?#10.1 U?#2.36)
NetJ?#5_1: Gate_Driver_Connectors (J?#5.1), Gate_Driver (U?#1.34)
NetJ?#5_2: Gate_Driver_Connectors (J?#5.2), Gate_Driver (U?#1.35)
NetJ?#5_3: Gate_Driver_Connectors (J?#5.3), Gate_Driver (U?#1.36)
NetJ?#5_4: Gate_Driver_Connectors (J?#5.4), Gate_Driver (U?#1.37)
NetJ?#5_5: Gate_Driver_Connectors (J?#5.5), Gate_Driver (U?#1.38)
NetJ?#5_6: Gate_Driver_Connectors (J?#5.6), Gate_Driver (U?#1.39)
NetJ?#6_1: Gate_Driver_Connectors (J?#6.1), Gate_Driver (U?#1.25)
NetJ?#6_2: Gate_Driver_Connectors (J?#6.2), Gate_Driver (U?#1.24)
NetJ?#6_3: Gate_Driver_Connectors (J?#6.3), Gate_Driver (U?#1.23)
NetJ?#7_1: Gate_Driver_Connectors (J?#7.1), Gate_Driver (LED?#1.2 R?#3.1 U?#1.28)
NetQ?#1_2: Gate_Driver (U?#1.8), Three_Phase_Inverter (Q?#1.2)
NetQ?#2_2: Gate_Driver (U?#1.17), Three_Phase_Inverter (Q?#2.2)
NetQ?#3_2: Gate_Driver (U?#1.18), Three_Phase_Inverter (Q?#3.2)
NetQ?#4_2: Gate_Driver (U?#1.10), Three_Phase_Inverter (Q?#4.2)
NetQ?#4_3: Gate_Driver (U?#1.11), Three_Phase_Inverter (Q?#4.3 R?#17.1 R?#20.2)
NetQ?#5_2: Gate_Driver (U?#1.15), Three_Phase_Inverter (Q?#5.2)
NetQ?#5_3: Gate_Driver (U?#1.14), Three_Phase_Inverter (Q?#5.3 R?#18.1 R?#21.2)
NetQ?#6_2: Gate_Driver (U?#1.20), Three_Phase_Inverter (Q?#6.2)
NetQ?#6_3: Gate_Driver (U?#1.21), Three_Phase_Inverter (Q?#6.3 R?#19.1 R?#22.2)